# EAGLE design dcdr_3.2 (EAGLE 9.6.2)
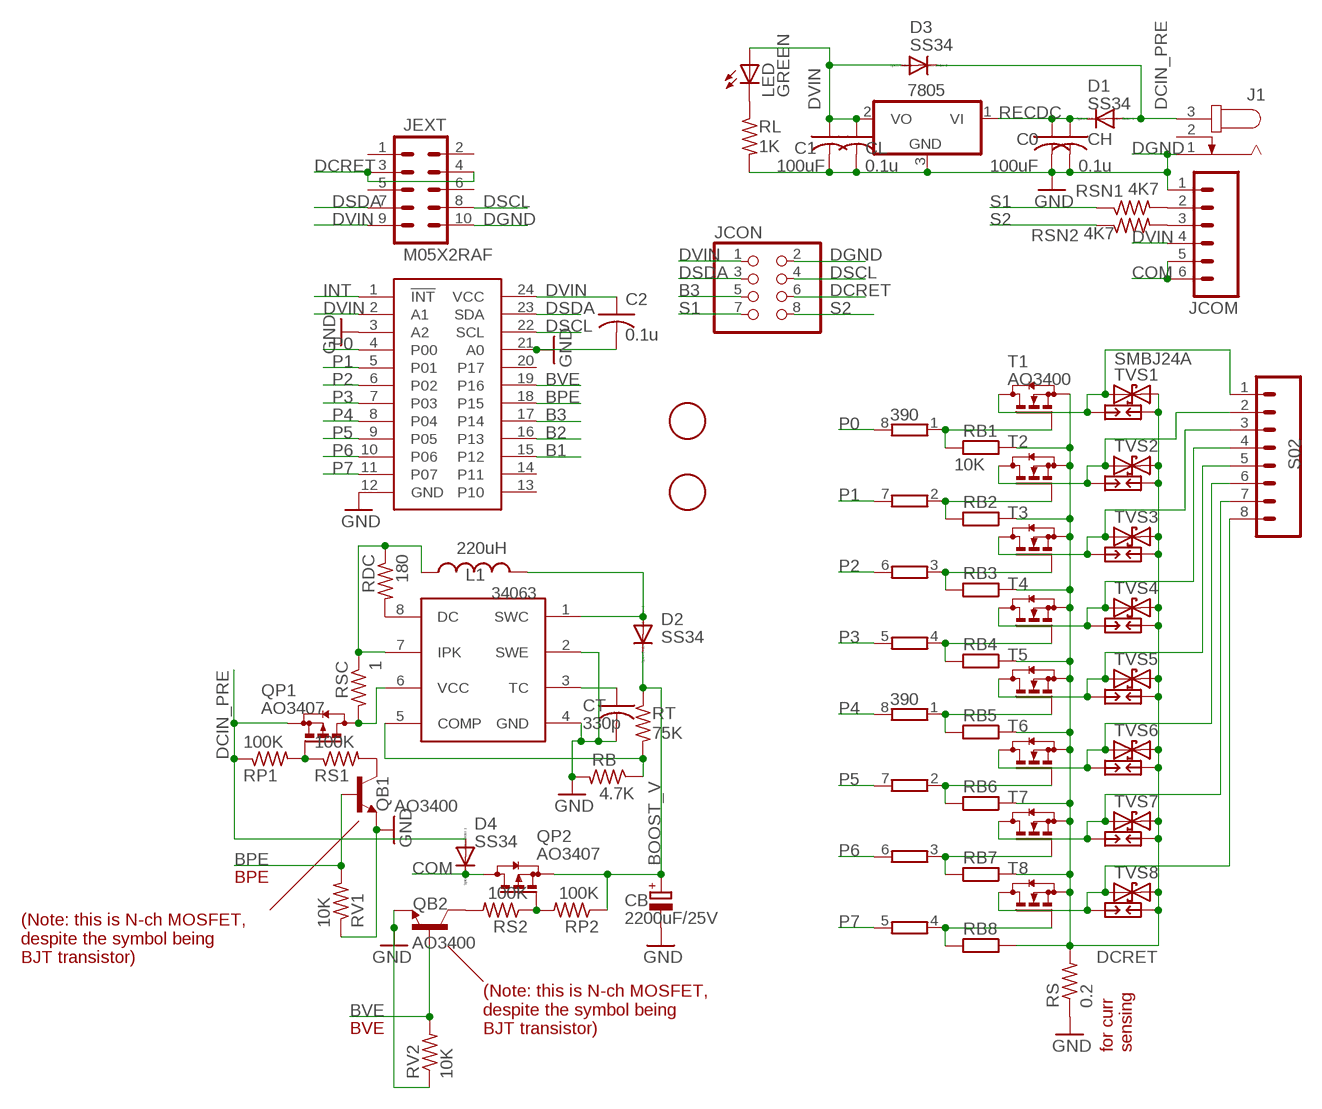
[diagram p0: schematic, sheet 1]

## Parts
7805  7805DT  [TO252]
34063  MC34063  MC33063/MC34063D  [SO08]
C0  100uF  C-USC0805K  [C0805K]
C1  100uF  C-USC0805K  [C0805K]
C2  0.1u  C-USC0603  [C0603]
CB  2200uF/25V  CPOL-EUE7.5-16  [E7,5-16]
CH  0.1u  C-USC0603  [C0603]
CL  0.1u  C-USC0603  [C0603]
CT  330p  C-USC0603K  [C0603K]
D1  SS34  DIODE-SMB  [SMB]
D2  SS34  DIODE-SMB  [SMB]
D3  SS34  DIODE-SMB  [SMB]
D4  SS34  DIODE-SMB  [SMB]
J1  JACK-PLUG0  [SPC4077]
JCOM  M065MM  [SCREWTERMINAL-5MM-6]
JCON  PINHD-2X4  [2X04]
JEXT  M05X2RAF  [2X5-RAF]
L1  220uH  INDUCTORCR54  [CR54]
LED  GREEN  LEDCHIPLED_0805  [CHIPLED_0805]
PCA9555  PCA9555  PCF8575TSSOP24  [TSSOP24]
QB1  AO3400  TRANSISTOR_NPNSOT23-3  [SOT23-3]
QB2  AO3400  TRANSISTOR_NPNSOT23-3  [SOT23-3]
QP1  AO3407  BSS84  [SOT23]
QP2  AO3407  BSS84  [SOT23]
RB  4.7K  R-US_R0603  [R0603]
RB1  10K  R-EU_R0603  [R0603]
RB2  10K  R-EU_R0603  [R0603]
RB3  10K  R-EU_R0603  [R0603]
RB4  10K  R-EU_R0603  [R0603]
RB5  10K  R-EU_R0603  [R0603]
RB6  10K  R-EU_R0603  [R0603]
RB7  10K  R-EU_R0603  [R0603]
RB8  10K  R-EU_R0603  [R0603]
RDC  180  R-US_R0603  [R0603]
RL  1K  R-US_R0603  [R0603]
RN1  390  4R-NEXB38V  [EXB38V]
RN2  390  4R-NEXB38V  [EXB38V]
RP1  100K  R-US_R0603  [R0603]
RP2  100K  R-US_R0603  [R0603]
RS  0.2  R-US_R2512  [R2512]
RS1  100K  R-US_R0603  [R0603]
RS2  100K  R-US_R0603  [R0603]
RSC  1  R-US_R0603  [R0603]
RSN1  4K7  R-US_R0603  [R0603]
RSN2  4K7  R-US_R0603  [R0603]
RT  75K  R-US_R0603  [R0603]
RV1  10K  R-US_R0603  [R0603]
RV2  10K  R-US_R0603  [R0603]
S02  M085MM-8  [SCREWTERMINAL-5MM-8]
SP1  PCB-SGAP  [PCB-SGAP]
SP2  PCB-SGAP  [PCB-SGAP]
SP3  PCB-SGAP  [PCB-SGAP]
SP4  PCB-SGAP  [PCB-SGAP]
SP5  PCB-SGAP  [PCB-SGAP]
SP6  PCB-SGAP  [PCB-SGAP]
SP7  PCB-SGAP  [PCB-SGAP]
SP8  PCB-SGAP  [PCB-SGAP]
T1  AO3400  BSS123  [SOT23]
T2  AO3400  BSS123  [SOT23]
T3  AO3400  BSS123  [SOT23]
T4  AO3400  BSS123  [SOT23]
T5  AO3400  BSS123  [SOT23]
T6  AO3400  BSS123  [SOT23]
T7  AO3400  BSS123  [SOT23]
T8  AO3400  BSS123  [SOT23]
TVS1  SMBJ24A  TVSSMB  [SMB]
TVS2  SMBJ24A  TVSSMB  [SMB]
TVS3  SMBJ24A  TVSSMB  [SMB]
TVS4  SMBJ24A  TVSSMB  [SMB]
TVS5  SMBJ24A  TVSSMB  [SMB]
TVS6  SMBJ24A  TVSSMB  [SMB]
TVS7  SMBJ24A  TVSSMB  [SMB]
TVS8  SMBJ24A  TVSSMB  [SMB]
U$1  FIDUCIAL  [FIDUCIAL_1MM]
U$2  FIDUCIAL  [FIDUCIAL_1MM]

## Nets
B1: PCA9555.15(P12)
B2: PCA9555.16(P13)
B3: JCON.5 PCA9555.17(P14)
BOOST_V: CB.+ D2.C QP2.2(S) RP2.1 RT.1
BPE: PCA9555.18(P15) QB1.1(B) RV1.2
BVE: PCA9555.19(P16) QB2.1(B) RV2.2
COM [power]: D4.C JCOM.5 JCOM.6 QP2.3(D)
DCIN_PRE: D1.A D3.C D4.A J1.3 QP1.2(S) RP1.1
DCRET: JCON.6 JEXT.3 JEXT.4 RB1.1 RB2.1 RB3.1 RB4.1 RB5.1 RB6.1 RB7.1 RB8.1 RS.2 SP1.1 SP2.1 SP3.1 SP4.1 SP5.1 SP6.1 SP7.1 SP8.1 T1.2(S) T2.2(S) T3.2(S) T4.2(S) T5.2(S) T6.2(S) T7.2(S) T8.2(S) TVS1.C TVS2.C TVS3.C TVS4.C TVS5.C TVS6.C TVS7.C TVS8.C
DGND [power]: 7805.3(GND) 34063.2(SWE) 34063.4(GND) C0.2 C1.2 C2.2 CB.- CH.2 CL.2 CT.2 J1.1 JCOM.1 JCON.2 JEXT.10 PCA9555.3(A2) PCA9555.12(GND) PCA9555.21(A0) QB1.2(E) QB2.2(E) RB.2 RL.2 RS.1 RV1.1 RV2.1 ; supply symbol labelled GND
DSCL [i2c]: JCON.4 JEXT.8 PCA9555.22(SCL)
DSDA [i2c]: JCON.3 JEXT.7 PCA9555.23(SDA)
DVIN [power]: 7805.2(VO) C1.1 C2.1 CL.1 D3.A JCOM.4 JCON.1 JEXT.9 LED.A PCA9555.2(A1) PCA9555.24(VCC)
INT: PCA9555.1(!INT)
N$1: 34063.1(SWC) D2.A L1.P$2
N$2: JCOM.2 RSN1.2
N$3: JCOM.3 RSN2.2
N$8: RB1.2 RN1.1 T1.1(G)
N$9: RB2.2 RN1.2 T2.1(G)
N$15: RB3.2 RN1.3 T3.1(G)
N$16: RB4.2 RN1.4 T4.1(G)
N$17: 34063.3(TC) CT.1
N$18: RB5.2 RN2.1 T5.1(G)
N$19: RB6.2 RN2.2 T6.1(G)
N$21: RB7.2 RN2.3 T7.1(G)
N$22: RB8.2 RN2.4 T8.1(G)
N$24: 34063.8(DC) RDC.2
N$26: 34063.7(IPK) L1.P$1 RDC.1 RSC.1
N$27: 34063.6(VCC) QP1.3(D) RSC.2
N$28: LED.C RL.1
N$29: 34063.5(COMP) RB.1 RT.2
N$30: QP1.1(G) RP1.2 RS1.1
N$34: QB2.3(C) RS2.2
N$35: QB1.3(C) RS1.2
N$38: QP2.1(G) RP2.2 RS2.1
N$50 [power]: S02.1 SP1.2 T1.3(D) TVS1.A
N$51 [power]: S02.2 SP2.2 T2.3(D) TVS2.A
N$52 [power]: S02.3 SP3.2 T3.3(D) TVS3.A
N$53 [power]: S02.4 SP4.2 T4.3(D) TVS4.A
N$54 [power]: S02.5 SP5.2 T5.3(D) TVS5.A
N$55 [power]: S02.6 SP6.2 T6.3(D) TVS6.A
N$56 [power]: S02.7 SP7.2 T7.3(D) TVS7.A
N$57 [power]: S02.8 SP8.2 T8.3(D) TVS8.A
P0: PCA9555.4(P00) RN1.8
P1: PCA9555.5(P01) RN1.7
P2: PCA9555.6(P02) RN1.6
P3: PCA9555.7(P03) RN1.5
P4: PCA9555.8(P04) RN2.8
P5: PCA9555.9(P05) RN2.7
P6: PCA9555.10(P06) RN2.6
P7: PCA9555.11(P07) RN2.5
RECDC: 7805.1(VI) C0.1 CH.1 D1.C
S1 [i2c]: JCON.7 RSN1.1
S2 [i2c]: JCON.8 RSN2.1
Unconnected: J1.2 JEXT.1 JEXT.2 JEXT.5 JEXT.6 PCA9555.13(P10) PCA9555.14(P11) PCA9555.20(P17)

## Notes on the sheet
- BPE
- (Note: this is N-ch MOSFET,
  despite the symbol being
  BJT transistor)
- BVE
- (Note: this is N-ch MOSFET,
  despite the symbol being
  BJT transistor)
- for curr
  sensing

## Library data of the parts
7805 = linear:78*: Positive VOLTAGE REGULATOR Source: http://cache.national.com/ds/LM/LM78L05.pdf http://www.fairchildsemi.com/ds/LM/LM7805.pdf
34063 = adafruit:MC33063/MC34063: MC33063 and MC34063 Basic DC/DC converter with internal power-NPN transistor, 100KHz, 1.5A peak switch current. 3-40 input/output.
C0 C1 C2 CH CL CT = adafruit:C-US: CAPACITOR, American symbol
CB = rcl:CPOL-EU: POLARIZED CAPACITOR, European symbol
D1-D4 = diode:DIODE-: DIODE
J1 = con-jack:JACK-PLUG: DC POWER JACK Power Jack, DC, Right Angle, Through Hole, Rated 5A at 16VDC, PC Terminals Distributor: Farnell (www.Farnell.de) Drawing: 84N1161.pdf / 84N1162.pdf Manufacturer: SPC Technology (www.spctechnology.com) Type: SPC4077 / SPC 4078; OC_FARNELL: unknown; OC_NEWARK: unknown
JCOM = SparkFun:M06: Header 6 Standard 6-pin 0.1" header. Use with straight break away headers (SKU : PRT-00116), right angle break away headers (PRT-00553), swiss pins (PRT-00743), machine pins (PRT-00117), and female headers (PRT-00115). Molex polarized connector foot print use with SKU : PRT-08094 with associated crimp pins and housings. NOTES ON THE VARIANTS LOCK and LOCK_LONGPADS... This footprint was designed to help hold the alignment of a through-hole component (i.e. 6-pin header) while soldering it into place. You may notice that each hole has been shifted either up or down by 0.005 of an inch from it's more standard position (which is a perfectly straight line). This slight alteration caused the pins (the squares in the middle) to touch the edges of the holes. Because they are alternating, it causes a "brace" to hold the component in place. 0.005 has proven to be the perfect amount of "off-center" position when using our standard breakaway headers. Although looks a little odd when you look at the bare footprint, once you have a header in there, the alteration is very hard to notice. Also, if you push a header all the way into place, it is covered up entirely on the bottom side. This idea of altering the position of holes to aid alignment will be further integrated into the Sparkfun Library for other footprints. It can help hold any component with 3 or more connection pins.
JCON = pinhead:PINHD-2X4: PIN HEADER
JEXT = SparkFunNew:M05X2: Header 5x2 Standard 10-pin dual row 0.1" header. Commonly used with AVR-ISP. Use with Spark Fun Electronics SKU: PRT-00778
L1 = SparkFunNew:INDUCTOR: Inductors Basic Inductor/Choke - 0603 and 1206. Footprints are not proven and vary greatly between part numbers.
LED = adafruit:LED: LED OSRAM: - CHIPLED LG R971, LG N971, LY N971, LG Q971, LY Q971, LO R971, LY R971 LH N974, LH R974 LS Q976, LO Q976, LY Q976 LO Q996 - Hyper CHIPLED LW Q18S LB Q993, LB Q99A, LB R99A - SideLED LS A670, LO A670, LY A670, LG A670, LP A670 LB A673, LV A673, LT A673, LW A673 LH A674 LY A675 LS A676, LA A676, LO A676, LY A676, LW A676 LS A679, LY A679, LG A679 - Hyper Micro SIDELED® LS Y876, LA Y876, LO Y876, LY Y876 LT Y87S - SmartLED LW L88C, LW L88S LB L89C, LB L89S, LG L890 LS L89K, LO L89K, LY L89K LS L896, LA L896, LO L896, LY L896 - TOPLED LS T670, LO T670, LY T670, LG T670, LP T670 LSG T670, LSP T670, LSY T670, LOP T670, LYG T670 LG T671, LOG T671, LSG T671 LB T673, LV T673, LT T673, LW T673 LH T674 LS T676, LA T676, LO T676, LY T676, LB T676, LH T676, LSB T676, LW T676 LB T67C, LV T67C, LT T67C, LS T67K, LO T67K, LY T67K, LW E67C LS E67B, LA E67B, LO E67B, LY E67B, LB E67C, LV E67C, LT E67C LW T67C LS T679, LY T679, LG T679 LS T770, LO T770, LY T770, LG T770, LP T770 LB T773, LV T773, LT T773, LW T773 LH T774 LS E675, LA E675, LY E675, LS T675 LS T776, LA T776, LO T776, LY T776, LB T776 LHGB T686 LT T68C, LB T68C - Hyper Mini TOPLED® LB M676 - Mini TOPLED Santana® LG M470 LS M47K, LO M47K, LY M47K Source: http://www.osram.convergy.de/
PCA9555 = SparkFunNew:PCF8575
QB1 QB2 = SparkFunNew:TRANSISTOR_NPN: Transistor NPN BJT configuration in SOT23 package. MMBT2222 is the common NPN we use. Double check BCE configuration again layout.
QP1 QP2 = transistor-small-signal:BSS84: P-CHANNEL MOS FET
RB RDC RP1 RP2 RS1 RS2 RSC RT RV1 RV2 = adafruitGood:R-US_: RESISTOR, American symbol
RB1-RB8 = rcl:R-EU_: RESISTOR, European symbol
RL RSN1 RSN2 = adafruit2013:R-US_: RESISTOR, American symbol
RN1 RN2 = resistor-dil:4R-N: Array Chip Resistor Source: RS Component / Phycomp; OC_FARNELL: unknown; OC_NEWARK: unknown
RS = adafruit:R-US_: RESISTOR, American symbol
S02 = SparkFun:M08: Header 8 Standard 8-pin 0.1" header. Use with straight break away headers (SKU : PRT-00116), right angle break away headers (PRT-00553), swiss pins (PRT-00743), machine pins (PRT-00117), and female headers (PRT-00115).
SP1-SP8 = varistor:PCB-SGAP
T1-T8 = transistor-small-signal:BSS123: N-CHANNEL MOS FET
TVS1-TVS8 = SparkFunNew:TVS
U$1 U$2 = adafruitGood:FIDUCIAL: For use by pick and place machines to calibrate the vision/machine, 1mm By microbuilder.eu

## Net classes
0 default: width 0.203 mm, clearance 0.178 mm
1 power: width 0.203 mm, clearance 0.178 mm
2 relaypower: width 0.203 mm, clearance 0.178 mm
3 signal: width 0.203 mm, clearance 0.178 mm
4 adc: width 0.406 mm, clearance 0.178 mm
5 i2c: width 0.305 mm, clearance 0.178 mm

## Board
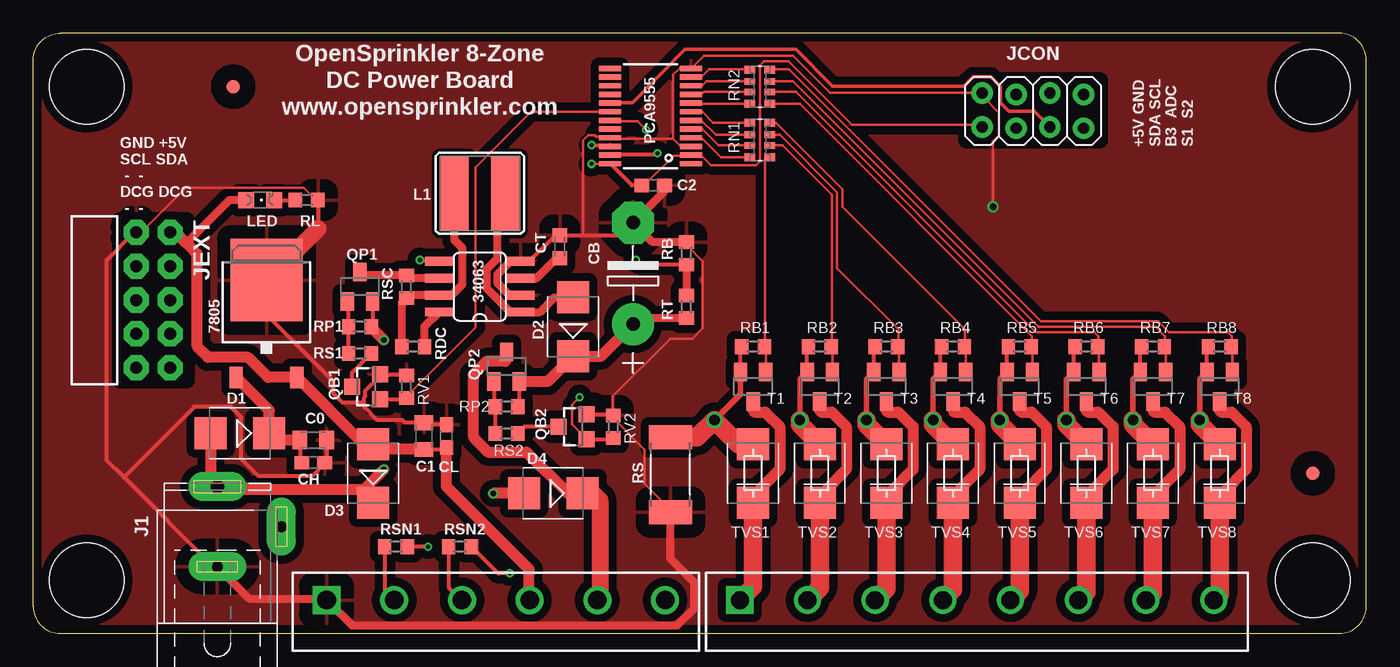
[diagram p1: board, top side]
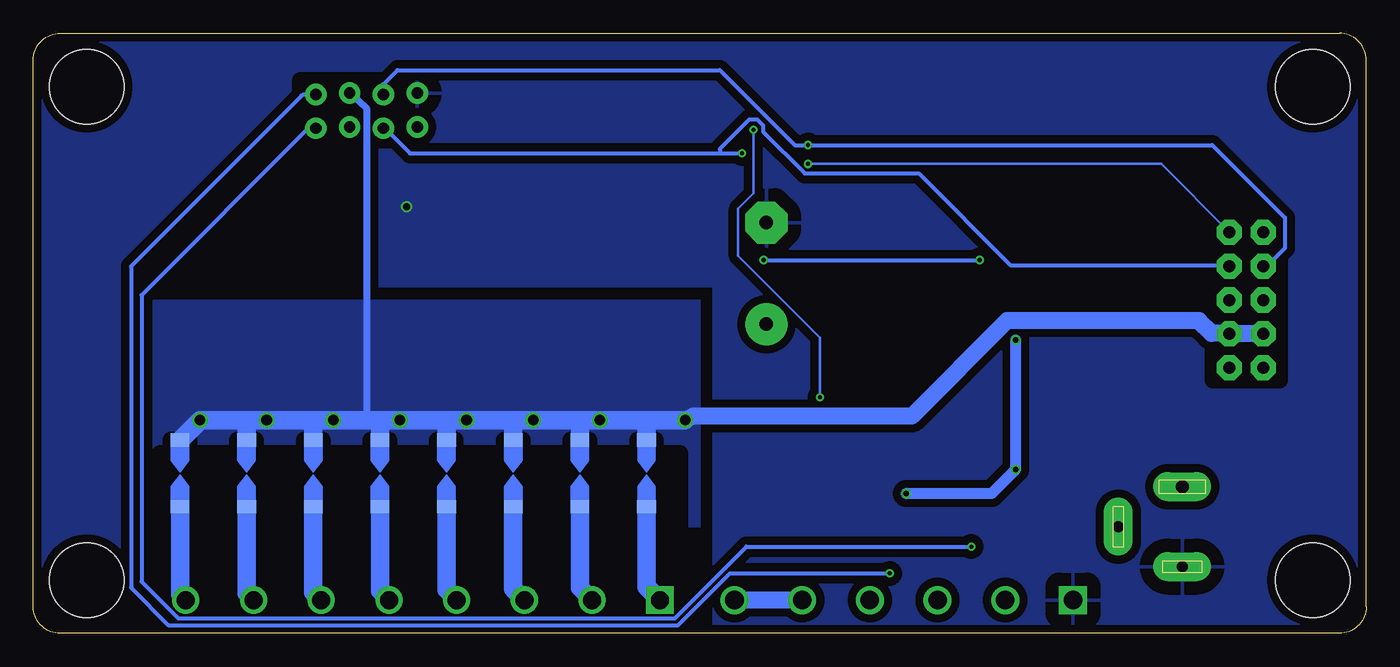
[diagram p2: board, bottom side, seen from below]

Size 100 x 45 mm. Coordinates in mm from the lower left corner, seen from the top.
Outline: 2,0 98,0 arc90 100,2 100,43 arc90 98,45 2,45 arc90 0,43 0,2 arc90 2,0
Copper layers (1*16): Top 0.035mm / dielectric 1.5mm / Bottom 0.035mm
Design rules "Fusion_eagle_rule_v1.1 *": minimum track width 6mil, minimum drill 12mil, track to track 6mil, track to pad 6mil, pad to pad 6mil, via to via 6mil, smd to smd 0mil, copper to edge 10mil, drill to drill 10mil, minimum pad ring 10mil, minimum via ring 6mil, stop-mask expansion 2mil, vias tented up to drill 100mil, thermal gap 40mil
Holes 5.6 mm at 4,4 96,4 4,41 96,41
tRestrict: area 70,37 to 80,41.5; area 6.5,19 to 11.5,31
bRestrict: area 51.5,3 to 90.5,13.5; area 72,37 to 80,41.5; area 6.5,19 to 11.5,31

### Footprints (pad centres in the part's own frame; a part is rotated, then mirrored left to right if it is on the bottom)
TO252 = smd 1 x 1.6: 1 -2.28,-4.8; 2 2.28,-4.8 | smd 5.4 x 6.2: 3 0,2.5
SO08 = smd 0.66 x 2.032: 1 -1.905,-3.073; 2 -0.635,-3.073; 3 0.635,-3.073; 4 1.905,-3.073; 5 1.905,3.073; 6 0.635,3.073; 7 -0.635,3.073; 8 -1.905,3.073
C0805K = smd 1.1 x 1.4: 1 -1,0; 2 1,0
C0603 = smd 1.1 x 1: 1 -0.85,0; 2 0.85,0
E7,5-16 = drill 1.016 pad 3.15: + -3.81,0 | drill 1.016 pad 3.15 octagon: - 3.81,0
C0603K = smd 1.05 x 1.08: 1 -0.875,0; 2 0.875,0
SMB = smd 2.4 x 2.4: A 2.2,0; C -2.2,0
SPC4077 = drill 0.8 pad 2.184 long: 1 -3,0; 2 0,-4.8 | drill 1 pad 2.184 long: 3 3,0
SCREWTERMINAL-5MM-6 = drill 1.4 pad 2.032 square: 1 0,0 | drill 1.4 pad 2.032: 2 5.08,0; 3 10.16,0; 4 15.24,0; 5 20.32,0; 6 25.4,0
2X04 = drill 0.85 pad 1.6: 1 -3.81,-1.219; 2 -3.81,1.321; 3 -1.27,-1.321; 4 -1.27,1.219; 5 1.27,-1.219; 6 1.27,1.321; 7 3.81,-1.321; 8 3.81,1.219
2X5-RAF = drill 0.9 pad 1.88 octagon: 1 -1.27,5.08; 2 1.27,5.08; 3 -1.27,2.54; 4 1.27,2.54; 5 -1.27,0; 6 1.27,0; 7 -1.27,-2.54; 8 1.27,-2.54; 9 -1.27,-5.08; 10 1.27,-5.08
CR54 = smd 5.5 x 2.15: P$1 0,1.92; P$2 0,-1.92
CHIPLED_0805 = smd 1.2 x 1.2: A 0,-1.05; C 0,1.05
TSSOP24 = smd 0.4 x 1.65: 1 -3.575,-3.05; 2 -2.925,-3.05; 3 -2.275,-3.05; 4 -1.625,-3.05; 5 -0.975,-3.05; 6 -0.325,-3.05; 7 0.325,-3.05; 8 0.975,-3.05; 9 1.625,-3.05; 10 2.275,-3.05; 11 2.925,-3.05; 12 3.575,-3.05; 13 3.575,3.05; 14 2.925,3.05; 15 2.275,3.05; 16 1.625,3.05; 17 0.975,3.05; 18 0.325,3.05; 19 -0.325,3.05; 20 -0.975,3.05; 21 -1.625,3.05; 22 -2.275,3.05; 23 -2.925,3.05; 24 -3.575,3.05
SOT23-3 = smd 1.2 x 1.2: 1 -0.95,-1; 2 0.95,-1; 3 0,1.1
SOT23 = smd 1 x 1.4: 1 -0.95,-1.1; 2 0.95,-1.1; 3 0,1.1
R0603 = smd 1 x 1.1: 1 -0.85,0; 2 0.85,0
EXB38V = smd 0.6 x 0.8: 1 -1.275,-0.75; 4 1.275,-0.75; 5 1.275,0.75; 8 -1.275,0.75 | smd 0.5 x 0.8: 2 -0.4,-0.75; 3 0.4,-0.75; 6 0.4,0.75; 7 -0.4,0.75
R2512 = smd 1.8 x 3.2: 1 -2.8,0; 2 2.8,0
SCREWTERMINAL-5MM-8 = drill 1.35 pad 2.032 square: 1 0,0 | drill 1.35 pad 2.032: 2 5.08,0; 3 10.16,0; 4 15.24,0; 5 20.32,0; 6 25.4,0; 7 30.48,0; 8 35.56,0
PCB-SGAP = smd 1 x 1.4 bottom: 1 -2.5,0; 2 2.5,0
FIDUCIAL_1MM = smd 1 x 1: 1 0,0

### Placement (x,y rotation side)
7805  17.5,24 0 top
34063  33.5,26 90 top
C0  21,14.5 0 top
C1  29.3,14.8 90 top
C2  46.5,33.6 0 top
CB  45,27 90 top
CH  21,12.8 0 top
CL  31,14.8 90 top
CT  39.5,29 90 top
D1  15.5,15 180 top
D2  40.5,23 90 top
D3  25.5,12 90 top
D4  39,10.5 180 top
J1  13.8,8 90 top
JCOM  22,2.5 0 top
JCON  75,39.2 0 top
JEXT  9,25 180 top
L1  33.5,33 90 top
LED  17,32.5 270 top
PCA9555  46.3,38.8 90 top
QB1  MMBT3904  [SOT23-3]  25,18.5 90 top
QB2  MMBT3904  [SOT23-3]  40.5,15.5 90 top
QP1  24.5,26 0 top
QP2  35.5,20 0 top
RB  49,28.5 90 top
RB1  54,21.5 0 top
RB2  59,21.5 0 top
RB3  64,21.5 0 top
RB4  69,21.5 0 top
RB5  74,21.5 0 top
RB6  79,21.5 0 top
RB7  84,21.5 0 top
RB8  89,21.5 0 top
RDC  28.5,21.5 0 top
RL  20.5,32.5 0 top
RN1  54.5,37 90 top
RN2  54.5,41 90 top
RP1  24.5,23 180 top
RP2  35.5,17 180 top
RS  47.8,11.9 90 top
RS1  24.5,21 0 top
RS2  35.5,15 0 top
RSC  28,26 90 top
RSN1  27.2,6.5 180 top
RSN2  32,6.5 180 top
RT  49,24.5 90 top
RV1  1K  [R0603]  28,18.5 270 top
RV2  1K  [R0603]  43.5,15.5 270 top
S02  53,2.5 0 top
SP1  54,12 270 top
SP2  59,12 270 top
SP3  64,12 270 top
SP4  69,12 270 top
SP5  74,12 270 top
SP6  79,12 270 top
SP7  84,12 270 top
SP8  89,12 270 top
T1  54,18.5 180 top
T2  59,18.5 180 top
T3  64,18.5 180 top
T4  69,18.5 180 top
T5  74,18.5 180 top
T6  79,18.5 180 top
T7  84,18.5 180 top
T8  89,18.5 180 top
TVS1  54,12 270 top
TVS2  59,12 270 top
TVS3  64,12 270 top
TVS4  69,12 270 top
TVS5  74,12 270 top
TVS6  79,12 270 top
TVS7  84,12 270 top
TVS8  89,12 270 top
U$1  15,41 0 top
U$2  96,12 0 top

### Tracks (layer width: path | path; a pad name or v marks a point on that pad's centre or on a via)
B3
  Top 0.254: JCON.5 76.25,38 75.1,39.15 73.2,39.15 72.55,39.8 72.55,41.05 71.85,41.75 70.5,41.75 69.8,41.05 59.95,41.05 57.2,43.8 48.9,43.8 44.95,39.8 43.25,39.8 PCA9555.17
BOOST_V
  Top 0.305: QP2.2 36.45,17.1 RP2.1
  Top 0.61: RT.1 45.46,23.65 CB.+
  Top 0.813: CB.+ 42.61,20.8 D2.C 38.6,18.9 QP2.2
BPE
  Top 0.203: PCA9555.18 43.2,39.12 37.34,39.12 33.18,34.96 33.18,22.96 28,17.78 RV1.2
  Top 0.305: QB1.1 27.9,17.55 RV1.2
BVE  (via drill 0.3)
  Top 0.203: v45.96,37.78 45.34,38.41 43.29,38.41 PCA9555.19 | v40.98,17.71 40.43,17.16 40.43,15.67 41.43,14.67 QB2.1
  Top 0.305: QB2.1 43.4,14.55 RV2.2
  Bottom 0.203: v45.96,37.78 45.96,33 47.12,31.84 47.12,28.32 40.98,22.18 v40.98,17.71
COM
  Top 0.813: QP2.3 35.5,20.5 35.4,20.4 34,20.4 33,19.4 33,14.8 33.2,14.5 34.1,13.6 37,13.6 40.1,10.5 D4.C
  Top 1.27: D4.C 42,10.5 42.5,10 42.5,2.5 JCOM.5
  Bottom 1.27: JCOM.5 JCOM.6
DCIN_PRE  (via drill 0.41)
  Top 0.305: QP1.2 25.45,23.1 RP1.1
  Top 0.813: v26.3,22 25.4,22.9 RP1.1 | v26.3,12.3 24.9,10.9 D3.C 24.5,10.8 14.4,10.8 J1.3 13.3,11.5 D1.A | D4.A v34.5,10.5
  Bottom 0.813: v26.3,22 v26.3,12.3 28.1,10.5 v34.5,10.5
DCRET  (via drill 0.8)
  Top 0.305: T1.2 53.05,21.4 RB1.1 | T2.2 58.05,21.4 RB2.1 | T3.2 63.05,21.4 RB3.1 | T4.2 68.05,21.4 RB4.1 | T5.2 73.05,21.4 RB5.1 | T6.2 78.05,21.4 RB6.1 | T7.2 83.05,21.4 RB7.1 | T8.2 88.05,21.4 RB8.1
  Top 0.406: T1.2 53.05,17.95 v51.1,16 | v57.5,16 57.5,19.05 T2.2 | v62.5,16 62.5,19.05 T3.2 | v67.5,16 67.5,19.05 T4.2 | v77.5,16 77.5,19.05 T6.2 | v82.5,16 82.5,19.05 T7.2 | v87.5,16 87.5,19.05 T8.2 | v72.5,16 72.5,19.05 T5.2
  Top 1.4: RS.2 49.8,14.7 v51.1,16 52.9,14.2 TVS1.C | v57.5,16 57.5,15.7 TVS2.C | v62.5,16 62.5,15.7 TVS3.C | v67.5,16 67.5,15.7 TVS4.C | v72.5,16 72.5,15.7 TVS5.C | v82.5,16 82.5,15.7 TVS7.C | v87.5,16 87.5,15.7 TVS8.C | v77.5,16 77.5,15.7 TVS6.C
  Bottom 0.508: 75,16 75,39.4 76.2,40.5 JCON.6
  Bottom 1.27: JEXT.4 JEXT.3 10.9,22.5 11.6,22.5 12.55,23.45 26.95,23.45 34.1,16.3 50.5,16.3 v51.1,16
  Bottom 1.4: v51.1,16 54,16 | 54,16 v57.5,16 59,16 | 59,16 v62.5,16 64,16 | 64,16 v67.5,16 69,16 | 69,16 v72.5,16 74,16 | 74,16 75,16 v77.5,16 79,16 | 79,16 v82.5,16 84,16 | 84,16 v87.5,16 SP8.1 | SP1.1 54,16 | SP2.1 59,16 | SP3.1 64,16 | SP4.1 69,16 | SP5.1 74,16 | SP7.1 84,16 | SP6.1 79,16
  pour Bottom (isolate 0.61): 50,25 91,25 91,8 50,8
DGND  (via drill 0.5 pad 0.41)
  Top 0.178: 41.25,29.88 41.25,36.98 41.6,37.34 42.14,37.34 42.23,37.25 43.2,37.25 PCA9555.21 | 21.25,32.54 RL.2 | RS.1 47.47,9.6 45.87,11.2 45.87,13.78 43.56,16.09 43.56,16.27 RV2.1 43.47,16.54 43.47,17.78 47.79,22.1 49.45,22.1 50.22,22.88 50.22,27.92 49.07,29.07 RB.2
  Top 0.203: 48,37.1 48.6,36.5 49.3,36.5 PCA9555.3 | 48,37.1 48,41.9 48.5,42.4 49.3,42.4 PCA9555.12 49.43,42.41 50.33,43.3 57,43.3 59.77,40.53 JCON.2 71.19,40.31 72.45,39.05 72.45,37.35 72,36.9 v72,32 | 48,37.1 43.33,37.1 PCA9555.21 | JEXT.10 7.82,30.14 8.12,30.14 11.41,33.43 20.27,33.43 21.16,32.54 RL.2
  Top 0.305: 34063.4 36.8,27.9 37.2,27.9 39.2,29.9 39.5,29.9 CT.2 41.25,29.88 44.06,29.88 CB.- | RL.2 21.35,30.35 | CL.2 29.45,15.65 C1.2 27.9,15.8 27.7,16 25.8,16 24.8,17 24.8,17.3 | RV1.1 27.9,19.45 QB1.2 26,19.3 24.9,18.2 24.9,17.8 24.8,17.7 24.8,17.3 | QB2.2 43.4,16.45 RV2.1 | 24.8,17.3 23.2,17.3 22.5,18 22.5,18.9 17.5,23.9 7805.3 | C0.2 22,12.95 CH.2 21.85,12.75 20.9,11.8 16.9,11.8 15.6,13.1 15.6,16.2 14.8,17 12.1,17 6.8,11.7 | 6.8,11.7 13.5,5 J1.1 | 6.8,11.7 5.5,13 5.5,28 7.5,30 JEXT.10
  Top 0.61: 34063.2 36.5,25.4 35.7,25.4 34.8,26.3 34.8,26.9 35.8,27.9 36.5,27.9 34063.4 | RB.2 46.46,29.35 CB.- 47.35,33.16 C2.2 | RS.1 47.8,5.6 49.6,3.8 49.6,1.9 48.3,0.6 23.9,0.6 JCOM.1 21.7,2.6 16.2,2.6 J1.1
  Top 1.27: 21.35,30.35 7805.3
  pour Top (isolate 0.61): 0,45 100,45 100,0 0,0
  pour Bottom (isolate 0.61): 0,45 100,45 100,0 92,0 92,26 49,26 49,0 0,0
DSCL  (via drill 0.3)
  Top 0.305: v41.88,36.62 43.25,36.62 PCA9555.22
  Bottom 0.305: JCON.4 73.73,41.2 72.67,42.25 48.5,42.25 42.88,36.62 v41.88,36.62 11.55,36.62 6.1,31.18 6.1,28.9 7.46,27.54 JEXT.8
DSDA  (via drill 0.3)
  Top 0.305: PCA9555.23 43.27,35.9 46.73,35.9 v46.83,36
  Bottom 0.305: 48.5,36 71.75,36 73.62,37.88 JCON.3 | 48.5,36 v46.83,36 | JEXT.7 10.38,27.62 26.7,27.62 33.58,34.5 42.12,34.5 45.25,37.62 45.25,38.1 45.7,38.55 46.27,38.55 48.5,36.33 48.5,36
DVIN  (via drill 0.3)
  Top 0.203: C2.1 45.84,33.61 48.06,35.83 49.34,35.83 PCA9555.2 49.43,35.83 50.14,35.83 50.85,35.12 54.23,35.12 54.51,35.39 54.51,42.59 54.81,42.9 56.67,42.9 61.43,38.14 71.12,38.14 JCON.1 | v41.87,35.2 43.12,35.2 PCA9555.24 | 11.76,29 11.72,28.96 11.47,29.27
  Top 0.305: C1.1 30.85,13.8 CL.1 | C2.1 44.9,33.6 43.3,35.2 PCA9555.24
  Top 0.61: 11.47,29.27 14.7,32.5 LED.A
  Top 0.813: 11.47,29.27 10.67,30.08 JEXT.9 | 11.55,29.2 11.76,29 12.3,28.45 12.3,21.5 13.1,20.7 16.1,20.7 17.6,19.2 7805.2 24.78,14.2 D3.A 25.9,13.8 C1.1 | CL.1 30.9,13.7 31,13.6 31,11 37.2,4.8 37.2,2.5 JCOM.4
  Bottom 0.203: v41.87,35.2 15.38,35.2 10.31,30.14 JEXT.9
N$1
  Top 0.61: L1.P$2 35.4,33 35.4,31.6 34.8,31 34.8,28.1 34,27.3 34,25.9 35.8,24.1 36.5,24.1 34063.1 36.8,24.1 38,24.1 39.1,25.2 D2.A
N$2
  Top 0.305: RSN1.2 26.4,6.5 26.4,3.1 27,2.5 JCOM.2
N$3
  Top 0.305: RSN2.2 31.2,6.5 31.2,3.4 32.1,2.5 JCOM.3
N$8
  Top 0.203: RN1.1 55.2,35.7 55,35.7 54.9,35.6 54.9,21.5 RB1.2 54.95,21.4 T1.1
N$9
  Top 0.203: RN1.2 56.2,36.6 59.9,32.9 59.9,21.5 RB2.2 59.95,21.4 T2.1
N$15
  Top 0.203: RN1.3 56,37.4 60.3,33.1 60.3,27.4 64.9,22.8 64.9,21.5 RB3.2 64.95,21.4 T3.1
N$16
  Top 0.203: RN1.4 55.3,38.3 55.7,38.3 60.7,33.3 60.7,32 69.9,22.8 69.9,21.5 RB4.2 69.95,21.4 T4.1
N$17
  Top 0.61: CT.1 39.5,28.1 39.2,28.1 37.7,26.6 36.6,26.6 34063.3
N$18
  Top 0.203: RN2.1 55.3,39.7 57.5,39.7 74.9,22.3 74.9,21.5 RB5.2 74.95,21.4 T5.1
N$19
  Top 0.203: RN2.2 57.2,40.6 75.2,22.6 79.6,22.6 79.9,22.3 79.9,21.5 RB6.2 79.95,21.4 T6.1
N$21
  Top 0.203: RN2.3 57,41.4 75.4,23 84.2,23 84.9,22.3 84.9,21.5 RB7.2 84.95,21.4 T7.1
N$22
  Top 0.203: RN2.4 55.3,42.3 56.7,42.3 75.6,23.4 84.4,23.4 85.2,22.6 89.6,22.6 89.9,22.3 89.9,21.5 RB8.2 89.95,21.4 T8.1
N$24
  Top 0.61: RDC.2 29.35,23.02 34063.8
N$26
  Top 0.61: L1.P$1 31.6,33 31.6,29.5 32.2,28.9 32.2,26.2 31.4,25.4 30.7,25.4 34063.7 28.21,25.36 RSC.1 27.65,24.8 RDC.1
N$27
  Top 0.61: QP1.3 24.75,26.85 RSC.2 28.21,26.64 34063.6
N$28
  Top 0.305: LED.C RL.1
N$29  (via drill 0.3)
  Top 0.305: RB.1 45.55,27.65 v45.2,28 | v29,28 30.33,28 34063.5
  Top 0.61: RB.1 RT.2
  Bottom 0.305: v45.2,28 v29,28
N$30
  Top 0.305: QP1.1 23.65,24.8 RP1.2 RS1.1
N$34
  Top 0.305: QB2.3 36.85,15.5 RS2.2
N$35
  Top 0.305: QB1.3 23.9,19.55 RS1.2
N$38
  Top 0.305: QP2.1 34.55,17.1 RP2.2 RS2.1
N$50
  Top 0.813: T1.3 54,16.7 54.1,16.6 54.9,16.6 56,15.5 56,12.3 54.3,10.6 54.3,10.4 TVS1.A
  Top 1.4: TVS1.A 54,3.5 S02.1
  Bottom 1.4: SP1.2 54,3.5 S02.1
N$51
  Top 0.813: T2.3 59,16.7 59.1,16.6 59.9,16.6 61,15.5 61,12.3 59.3,10.6 59.3,10.4 TVS2.A
  Top 1.4: TVS2.A 59,3.42 S02.2
  Bottom 1.4: SP2.2 59,3.42 S02.2
N$52
  Top 0.813: T3.3 64,16.7 64.1,16.6 64.9,16.6 66,15.5 66,12.3 64.3,10.6 64.3,10.4 TVS3.A
  Top 1.4: TVS3.A 64,3.34 S02.3
  Bottom 1.4: SP3.2 64,3.34 S02.3
N$53
  Top 0.813: T4.3 69,16.7 69.1,16.6 69.9,16.6 71,15.5 71,12.3 69.3,10.6 69.3,10.4 TVS4.A
  Top 1.4: TVS4.A 69,3.26 S02.4
  Bottom 1.4: SP4.2 69,3.26 S02.4
N$54
  Top 0.813: T5.3 74,16.7 74.1,16.6 74.9,16.6 76,15.5 76,12.3 74.3,10.6 74.3,10.4 TVS5.A
  Top 1.4: TVS5.A 74,3.18 S02.5
  Bottom 1.4: SP5.2 74,3.18 S02.5
N$55
  Top 0.813: T6.3 79,16.7 79.1,16.6 79.9,16.6 81,15.5 81,12.3 79.3,10.6 79.3,10.4 TVS6.A
  Top 1.4: TVS6.A 79,3.1 S02.6
  Bottom 1.4: SP6.2 79,3.1 S02.6
N$56
  Top 0.813: T7.3 84,16.7 84.1,16.6 84.9,16.6 86,15.5 86,12.3 84.3,10.6 84.3,10.4 TVS7.A
  Top 1.4: TVS7.A 84,3.02 S02.7
  Bottom 1.4: SP7.2 84,3.02 S02.7
N$57
  Top 0.813: T8.3 89,16.7 89.1,16.6 89.9,16.6 91,15.5 91,12.3 89.3,10.6 89.3,10.4 TVS8.A
  Top 1.4: TVS8.A 89,2.94 S02.8
  Bottom 1.4: SP8.2 89,2.94 S02.8
P0
  Top 0.203: RN1.8 53.7,35.7 51.6,35.7 50.1,37.2 49.4,37.2 PCA9555.4
P1
  Top 0.203: RN1.7 51.4,36.6 50.2,37.8 49.4,37.8 PCA9555.5
P2
  Top 0.203: RN1.6 51.2,37.4 50.1,38.5 49.4,38.5 PCA9555.6
P3
  Top 0.203: RN1.5 53.7,38.3 51,38.3 50.2,39.1 49.4,39.1 PCA9555.7
P4
  Top 0.203: RN2.8 53.7,39.7 50,39.7 49.9,39.8 49.4,39.8 PCA9555.8
P5
  Top 0.203: RN2.7 50.3,40.6 50.1,40.4 49.4,40.4 PCA9555.9
P6
  Top 0.203: RN2.6 50.5,41.4 50.2,41.1 49.4,41.1 PCA9555.10
P7
  Top 0.203: RN2.5 53.7,42.3 50.7,42.3 50.1,41.7 49.4,41.7 PCA9555.11
RECDC
  Top 0.305: C0.1 20,12.95 CH.1
  Top 0.813: 7805.1 17.7,16.72 D1.C 18.2,14.5 C0.1
S1  (via drill 0.3)
  Top 0.305: v29.62,6.5 RSN1.1
  Bottom 0.305: v29.62,6.5 46.5,6.5 51.88,1.12 89.12,1.12 91.88,3.88 91.88,25.38 79.38,37.88 78.88,37.88 JCON.7
S2  (via drill 0.3)
  Top 0.305: v35.75,4.5 34.88,4.5 32.88,6.5 RSN2.1
  Bottom 0.305: v35.75,4.5 47.75,4.5 51.62,0.62 89.88,0.62 92.67,3.42 92.67,27.52 79.88,40.33 79.74,40.42 JCON.8

### Text on the board
tNames: OpenSprinkler 8-Zone | DC Power Board | www.opensprinkler.com | +5V GND / SDA SCL / B3 ADC / S1 S2 | GND +5V / SCL SDA / - - / DCG DCG / - -